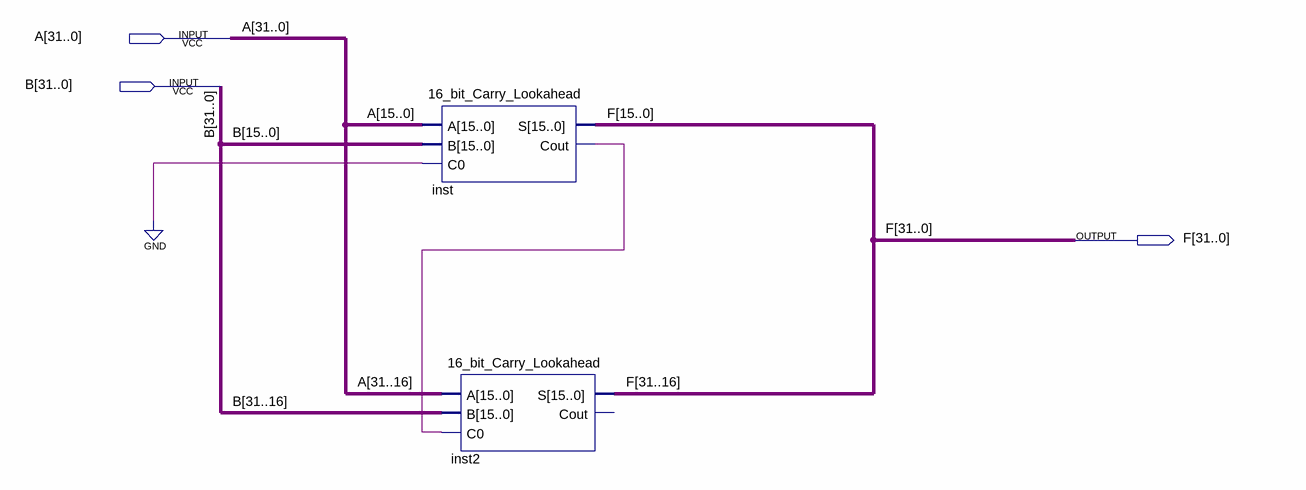
[diagram p0: schematic sheet]
// Quartus schematic CarryLookAheadAdder32bits.bdf as structural Verilog: 2 symbols, 3 pins
module CarryLookAheadAdder32bits (
  input  [31:0] A,
  input  [31:0] B,
  output [31:0] F
);

  wire inst_cout;

  \16_bit_Carry_Lookahead  inst (.A(A[15:0]), .B(B[15:0]), .C0(1'b0), .Cout(inst_cout), .S(F[15:0]));
  \16_bit_Carry_Lookahead  inst2 (.A(A[31:16]), .B(B[31:16]), .C0(inst_cout), .S(F[31:16]));  // open: Cout
endmodule
